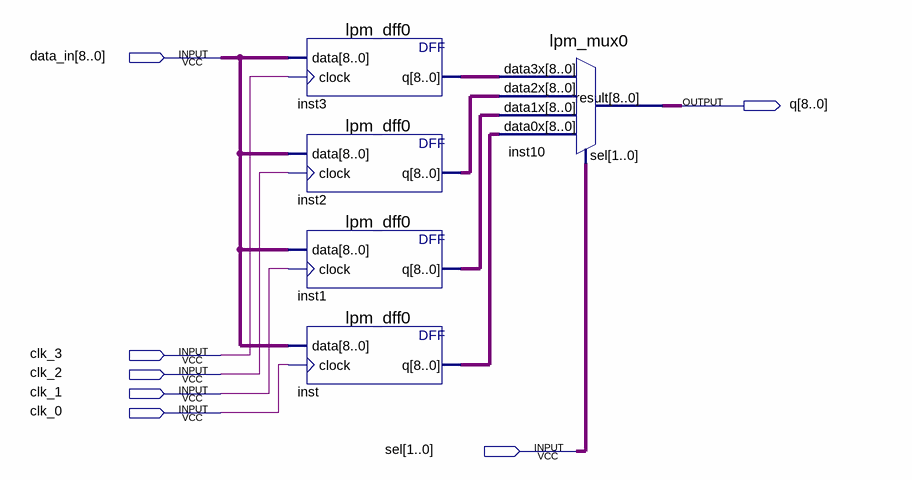
[diagram p0: schematic sheet]
// Quartus schematic registers.bdf as structural Verilog: 5 symbols, 7 pins
module registers (
  input  [8:0] data_in,
  input  clk_3,
  input  clk_2,
  input  clk_1,
  input  clk_0,
  input  [1:0] sel,
  output [8:0] q
);

  wire [8:0] inst1_q, inst2_q, inst3_q, inst_q;

  lpm_dff0 inst3 (.data(data_in), .clock(clk_3), .q(inst3_q));
  lpm_dff0 inst2 (.data(data_in), .clock(clk_2), .q(inst2_q));
  lpm_dff0 inst1 (.data(data_in), .clock(clk_1), .q(inst1_q));
  lpm_dff0 inst (.data(data_in), .clock(clk_0), .q(inst_q));
  lpm_mux0 inst10 (.data3x(inst3_q), .data2x(inst2_q), .data1x(inst1_q), .data0x(inst_q), .sel(sel), .result(q));
endmodule
